# EAGLE design ClockMultiplier (EAGLE 7.5.0)
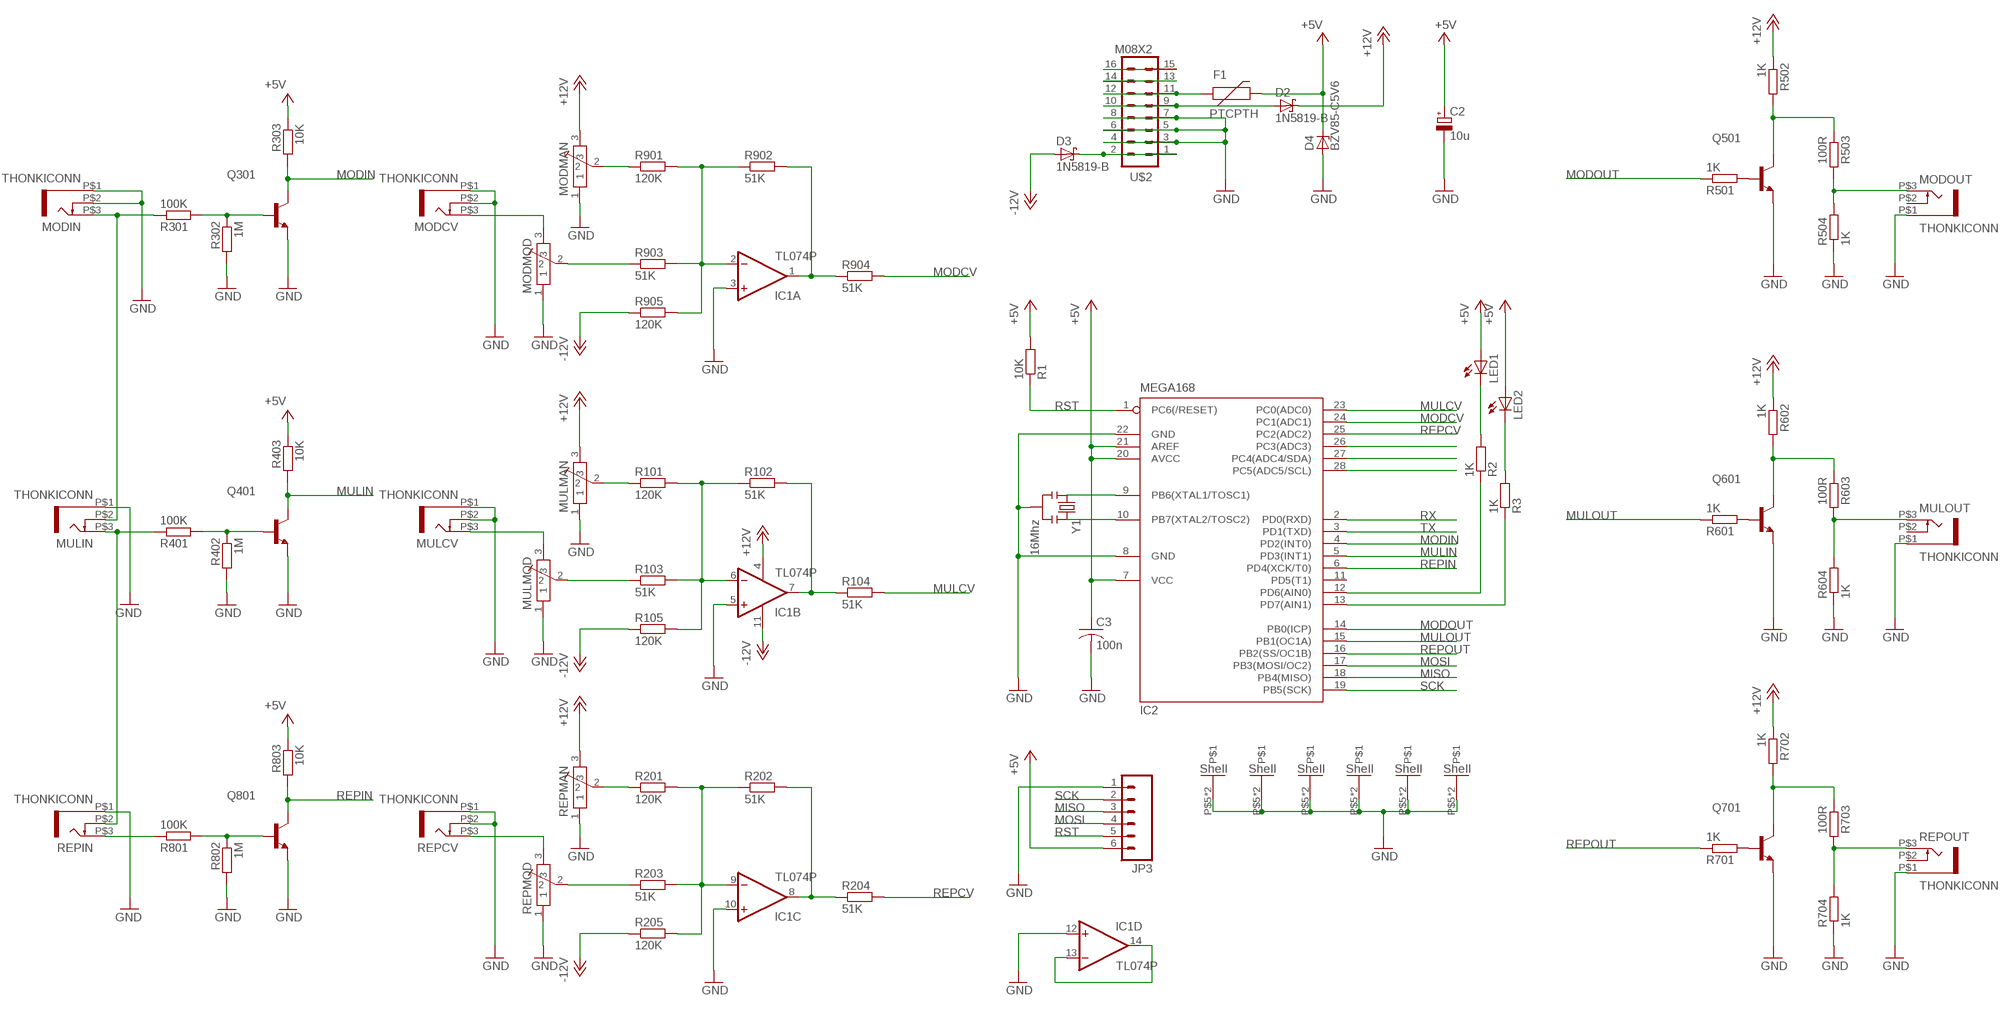
[diagram p0: schematic, sheet 1]

## Parts
C2  10u  CPOL-EUE5-6  [E5-6]
C3  100n  C-US050-024X044  [C050-024X044]
D2  1N5819-B  [DO41-7.6]
D3  1N5819-B  [DO41-7.6]
D4  BZV85-C5V6  ZENER-DIODEDO34-7  [DO34Z7]
F1  PTCPTH  [PTC]
IC1  TL074P  [DIL14]
IC2  MEGA168  MEGA8-P  [DIL28-3]
JP3  M06SIP  [1X06]
LED1  LED3MM  [LED3MM]
LED2  LED3MM  [LED3MM]
MODCV  THONKICONN  [THONKICONN]
MODIN  THONKICONN  [THONKICONN]
MODMAN  POT-ALPS-RK09L1140  [POT-ALPS-RK09L1140]
MODMOD  POT-ALPS-RK09L1140  [POT-ALPS-RK09L1140]
MODOUT  THONKICONN  [THONKICONN]
MULCV  THONKICONN  [THONKICONN]
MULIN  THONKICONN  [THONKICONN]
MULMAN  POT-ALPS-RK09L1140  [POT-ALPS-RK09L1140]
MULMOD  POT-ALPS-RK09L1140  [POT-ALPS-RK09L1140]
MULOUT  THONKICONN  [THONKICONN]
Q301  2N3904-NPN-TO92-EBC  [TO92-EBC]
Q401  2N3904-NPN-TO92-EBC  [TO92-EBC]
Q501  2N3904-NPN-TO92-EBC  [TO92-EBC]
Q601  2N3904-NPN-TO92-EBC  [TO92-EBC]
Q701  2N3904-NPN-TO92-EBC  [TO92-EBC]
Q801  2N3904-NPN-TO92-EBC  [TO92-EBC]
R1  10K  R-EU_0204/7  [0204/7]
R2  1K  R-EU_0204/7  [0204/7]
R3  1K  R-EU_0204/7  [0204/7]
R101  120K  R-EU_0204/7  [0204/7]
R102  51K  R-EU_0204/7  [0204/7]
R103  51K  R-EU_0204/7  [0204/7]
R104  51K  R-EU_0204/7  [0204/7]
R105  120K  R-EU_0204/7  [0204/7]
R201  120K  R-EU_0204/7  [0204/7]
R202  51K  R-EU_0204/7  [0204/7]
R203  51K  R-EU_0204/7  [0204/7]
R204  51K  R-EU_0204/7  [0204/7]
R205  120K  R-EU_0204/7  [0204/7]
R301  100K  R-EU_0204/7  [0204/7]
R302  1M  R-EU_0204/7  [0204/7]
R303  10K  R-EU_0204/7  [0204/7]
R401  100K  R-EU_0204/7  [0204/7]
R402  1M  R-EU_0204/7  [0204/7]
R403  10K  R-EU_0204/7  [0204/7]
R501  1K  R-EU_0204/7  [0204/7]
R502  1K  R-EU_0204/7  [0204/7]
R503  100R  R-EU_0204/7  [0204/7]
R504  1K  R-EU_0204/7  [0204/7]
R601  1K  R-EU_0204/7  [0204/7]
R602  1K  R-EU_0204/7  [0204/7]
R603  100R  R-EU_0204/7  [0204/7]
R604  1K  R-EU_0204/7  [0204/7]
R701  1K  R-EU_0204/7  [0204/7]
R702  1K  R-EU_0204/7  [0204/7]
R703  100R  R-EU_0204/7  [0204/7]
R704  1K  R-EU_0204/7  [0204/7]
R801  100K  R-EU_0204/7  [0204/7]
R802  1M  R-EU_0204/7  [0204/7]
R803  10K  R-EU_0204/7  [0204/7]
R901  120K  R-EU_0204/7  [0204/7]
R902  51K  R-EU_0204/7  [0204/7]
R903  51K  R-EU_0204/7  [0204/7]
R904  51K  R-EU_0204/7  [0204/7]
R905  120K  R-EU_0204/7  [0204/7]
REPCV  THONKICONN  [THONKICONN]
REPIN  THONKICONN  [THONKICONN]
REPMAN  POT-ALPS-RK09L1140  [POT-ALPS-RK09L1140]
REPMOD  POT-ALPS-RK09L1140  [POT-ALPS-RK09L1140]
REPOUT  THONKICONN  [THONKICONN]
U$2  M08X2  [2X8]
Y1  16Mhz  RESONATORPTH  [RESONATOR-PTH]

## Nets
+5V: C2.+ C3.1 D4.C F1.P$2 IC2.7(VCC) IC2.20(AVCC) IC2.21(AREF) JP3.6 LED1.A LED2.A R1.2 R303.1 R403.1 R803.1
+12V: D2.C IC1.4(P:V+) MODMAN.3 MULMAN.3 R502.1 R602.1 R702.1 REPMAN.3
-12V: D3.A IC1.11(P:V-) R105.1 R205.1 R905.1
DURSW: MODIN.P$3 MULIN.P$2 R301.1
GND: C2.- C3.2 D4.A IC1.3(A:+IN) IC1.5(B:+IN) IC1.10(C:+IN) IC1.12(D:+IN) IC2.8(GND) IC2.22(GND) JP3.1 MODCV.P$1 MODCV.P$2 MODIN.P$1 MODIN.P$2 MODMAN.1 MODMAN.P$5 MODMAN.P$6 MODMOD.1 MODMOD.P$5 MODMOD.P$6 MODOUT.P$1 MULCV.P$1 MULCV.P$2 MULIN.P$1 MULMAN.1 MULMAN.P$5 MULMAN.P$6 MULMOD.1 MULMOD.P$5 MULMOD.P$6 MULOUT.P$1 Q301.E Q401.E Q501.E Q601.E Q701.E Q801.E R302.2 R402.2 R504.1 R604.1 R704.1 R802.2 REPCV.P$1 REPCV.P$2 REPIN.P$1 REPMAN.1 REPMAN.P$5 REPMAN.P$6 REPMOD.1 REPMOD.P$5 REPMOD.P$6 REPOUT.P$1 U$2.3 U$2.4 U$2.5 U$2.6 U$2.7 U$2.8 Y1.2
MISO: IC2.18(PB4(MISO)) JP3.3
MODCV: IC2.24(PC1(ADC1)) R904.2
MODIN: IC2.4(PD2(INT0)) Q301.C R303.2
MODOUT: IC2.14(PB0(ICP)) R501.1
MOSI: IC2.17(PB3(MOSI/OC2)) JP3.4
MULCV: IC2.23(PC0(ADC0)) R104.2
MULIN: IC2.5(PD3(INT1)) Q401.C R403.2
MULOUT: IC2.15(PB1(OC1A)) R601.1
N$1: MULCV.P$3 MULMOD.3
N$2: IC1.6(B:-IN) R101.2 R102.1 R103.2 R105.2
N$3: MULMAN.2 R101.1
N$4: IC1.7(B:OUT) R102.2 R104.1
N$5: MULMOD.2 R103.1
N$6: D3.C U$2.1 U$2.2
N$7: IC1.9(C:-IN) R201.2 R202.1 R203.2 R205.2
N$8: R201.1 REPMAN.2
N$9: IC1.8(C:OUT) R202.2 R204.1
N$10: R203.1 REPMOD.2
N$11: IC1.13(D:-IN) IC1.14(D:OUT)
N$12: REPCV.P$3 REPMOD.3
N$13: IC2.26(PC3(ADC3))
N$14: IC2.27(PC4(ADC4/SDA))
N$15: IC2.28(PC5(ADC5/SCL))
N$16: IC1.2(A:-IN) R901.2 R902.1 R903.2 R905.2
N$17: MODMAN.2 R901.1
N$18: IC1.1(A:OUT) R902.2 R904.1
N$19: MODMOD.2 R903.1
N$20: IC2.9(PB6(XTAL1/TOSC1)) Y1.1
N$21: IC2.10(PB7(XTAL2/TOSC2)) Y1.3
N$22: MODCV.P$3 MODMOD.3
N$23: LED1.K(C) R2.2
N$24: LED2.K(C) R3.2
N$25: IC2.13(PD7(AIN1)) R3.1
N$26: Q601.B R601.2
N$27: Q301.B R301.2 R302.1
N$28: MODOUT.P$3 R503.2 R504.2
N$29: IC2.12(PD6(AIN0)) R2.1
N$30: MULOUT.P$3 R603.2 R604.2
N$31: Q401.B R401.2 R402.1
N$32: Q601.C R602.2 R603.1
N$33: Q501.B R501.2
N$34: Q701.B R701.2
N$35: R703.2 R704.2 REPOUT.P$3
N$36: MULIN.P$3 R401.1 REPIN.P$2
N$37: Q501.C R502.2 R503.1
N$38: Q701.C R702.2 R703.1
N$39: Q801.B R801.2 R802.1
N$41: R801.1 REPIN.P$3
N$43: U$2.13 U$2.14
N$44: F1.P$1 U$2.11 U$2.12
N$45: D2.A U$2.9 U$2.10
PWR_BUS: U$2.15 U$2.16
REPCV: IC2.25(PC2(ADC2)) R204.2
REPIN: IC2.6(PD4(XCK/T0)) Q801.C R803.2
REPOUT: IC2.16(PB2(SS/OC1B)) R701.1
RST: IC2.1(PC6(/RESET)) JP3.5 R1.1
RX: IC2.2(PD0(RXD))
SCK: IC2.19(PB5(SCK)) JP3.2
TX: IC2.3(PD1(TXD))
Unconnected: IC2.11(PD5(T1)) MODOUT.P$2 MULOUT.P$2 REPOUT.P$2

## Library data of the parts
C2 = rcl:CPOL-EU: POLARIZED CAPACITOR, European symbol
C3 = rcl:C-US: CAPACITOR, American symbol
D2 D3 = diode:1N581*: 1.0A SCHOTTKY BARRIER RECTIFIER Source: http://www.diodes.com/datasheets/ds23001.pdf
D4 = diode:ZENER-DIODE: Z-Diode
F1 = Rebel:PTC: Resettable Fuse PTC
IC1 = linear:TL074: OP AMP
IC2 = atmel:MEGA8-P: MICROCONTROLLER 8 Kbytes FLASH, 1 kbytes SRAM, 512 bytes EEPROM, USART, 4-channel 10 bit ADC, 2-channel 8 bit ADC Pin compatible with Atmega48, ATMega88, ATMega168 Source: avr.lbr; OC_FARNELL: unknown; OC_NEWARK: unknown
JP3 = SparkFun:M06: Header 6 Standard 6-pin 0.1" header. Use with straight break away headers (SKU : PRT-00116), right angle break away headers (PRT-00553), swiss pins (PRT-00743), machine pins (PRT-00117), and female headers (PRT-00115). Molex polarized connector foot print use with SKU : PRT-08094 with associated crimp pins and housings. NOTES ON THE VARIANTS LOCK and LOCK_LONGPADS... This footprint was designed to help hold the alignment of a through-hole component (i.e. 6-pin header) while soldering it into place. You may notice that each hole has been shifted either up or down by 0.005 of an inch from it's more standard position (which is a perfectly straight line). This slight alteration caused the pins (the squares in the middle) to touch the edges of the holes. Because they are alternating, it causes a "brace" to hold the component in place. 0.005 has proven to be the perfect amount of "off-center" position when using our standard breakaway headers. Although looks a little odd when you look at the bare footprint, once you have a header in there, the alteration is very hard to notice. Also, if you push a header all the way into place, it is covered up entirely on the bottom side. This idea of altering the position of holes to aid alignment will be further integrated into the Sparkfun Library for other footprints. It can help hold any component with 3 or more connection pins.
LED1 LED2 = Rebel:LED: LED OSRAM: - CHIPLED LG R971, LG N971, LY N971, LG Q971, LY Q971, LO R971, LY R971 LH N974, LH R974 LS Q976, LO Q976, LY Q976 LO Q996 - Hyper CHIPLED LW Q18S LB Q993, LB Q99A, LB R99A - SideLED LS A670, LO A670, LY A670, LG A670, LP A670 LB A673, LV A673, LT A673, LW A673 LH A674 LY A675 LS A676, LA A676, LO A676, LY A676, LW A676 LS A679, LY A679, LG A679 - Hyper Micro SIDELED® LS Y876, LA Y876, LO Y876, LY Y876 LT Y87S - SmartLED LW L88C, LW L88S LB L89C, LB L89S, LG L890 LS L89K, LO L89K, LY L89K LS L896, LA L896, LO L896, LY L896 - TOPLED LS T670, LO T670, LY T670, LG T670, LP T670 LSG T670, LSP T670, LSY T670, LOP T670, LYG T670 LG T671, LOG T671, LSG T671 LB T673, LV T673, LT T673, LW T673 LH T674 LS T676, LA T676, LO T676, LY T676, LB T676, LH T676, LSB T676, LW T676 LB T67C, LV T67C, LT T67C, LS T67K, LO T67K, LY T67K, LW E67C LS E67B, LA E67B, LO E67B, LY E67B, LB E67C, LV E67C, LT E67C LW T67C LS T679, LY T679, LG T679 LS T770, LO T770, LY T770, LG T770, LP T770 LB T773, LV T773, LT T773, LW T773 LH T774 LS E675, LA E675, LY E675, LS T675 LS T776, LA T776, LO T776, LY T776, LB T776 LHGB T686 LT T68C, LB T68C - Hyper Mini TOPLED® LB M676 - Mini TOPLED Santana® LG M470 LS M47K, LO M47K, LY M47K Source: http://www.osram.convergy.de LUXEON: - LUMILED® LXK2-PW12-R00, LXK2-PW12-S00, LXK2-PW14-U00, LXK2-PW14-V00 LXK2-PM12-R00, LXK2-PM12-S00, LXK2-PM14-U00 LXK2-PE12-Q00, LXK2-PE12-R00, LXK2-PE12-S00, LXK2-PE14-T00, LXK2-PE14-U00 LXK2-PB12-K00, LXK2-PB12-L00, LXK2-PB12-M00, LXK2-PB14-N00, LXK2-PB14-P00, LXK2-PB14-Q00 LXK2-PR12-L00, LXK2-PR12-M00, LXK2-PR14-Q00, LXK2-PR14-R00 LXK2-PD12-Q00, LXK2-PD12-R00, LXK2-PD12-S00 LXK2-PH12-R00, LXK2-PH12-S00 LXK2-PL12-P00, LXK2-PL12-Q00, LXK2-PL12-R00 Source: www.luxeon.com KINGBRIGHT: KA-3528ASYC Source: www.kingbright.com
MODCV MODIN MODOUT MULCV MULIN MULOUT REPCV REPIN REPOUT = Rebel:THONKICONN
MODMAN MODMOD MULMAN MULMOD REPMAN REPMOD = Rebel:POT-ALPS-RK09L
Q301 Q401 Q501 Q601 Q701 Q801 = transistor-neu-to92:*-NPN-: NPN Transistror
R1-R3 R101-R105 R201-R205 R301-R303 R401-R403 R501-R504 R601-R604 R701-R704 R801-R803 R901-R905 = Rebel:R-EU_: RESISTOR, European symbol
U$2 = SparkFun:M08X2
Y1 = SparkFun:RESONATOR: Resonator Small SMD resonator. This is the itty bitty 10/20MHz resonators with built in caps. CSTCE10M0G55 and CSTCE20M0V53. Footprint has been reviewed closely but hasn't been tested yet.

## Board
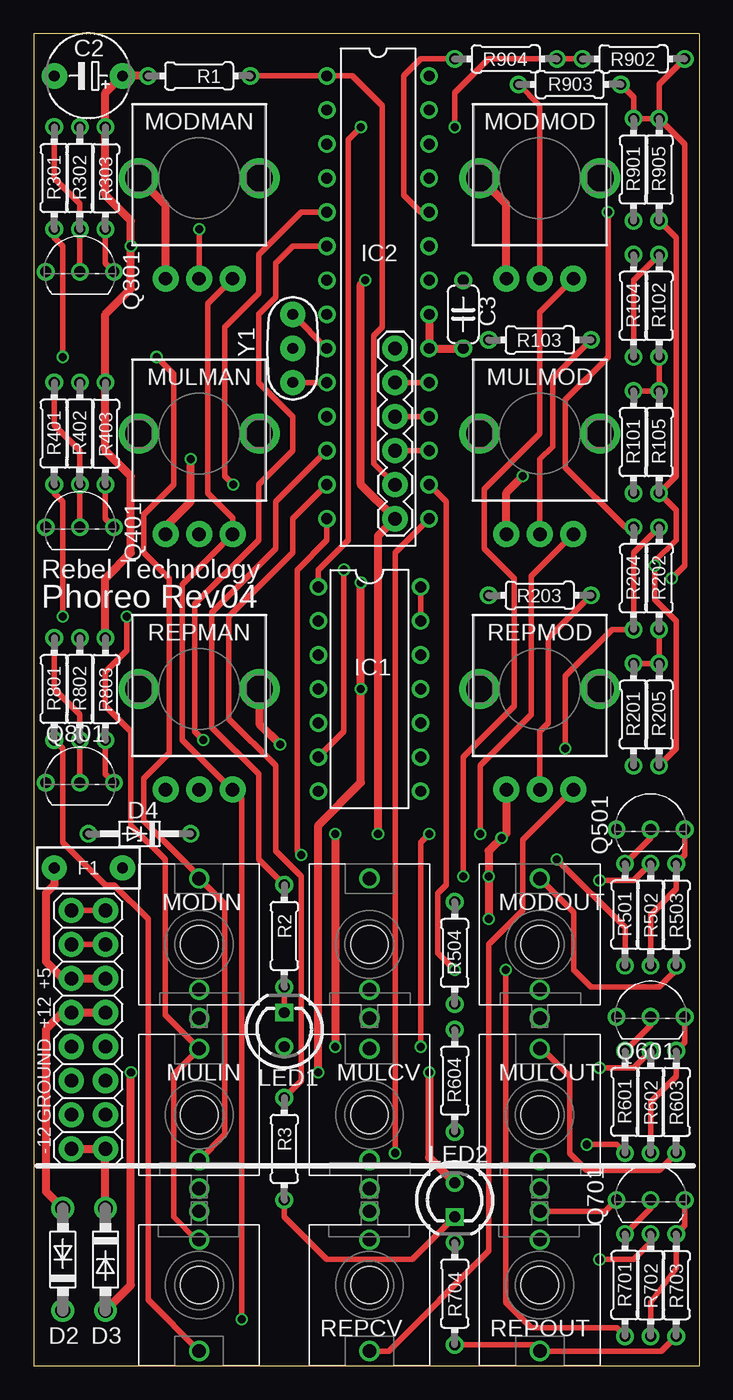
[diagram p1: board, top side]
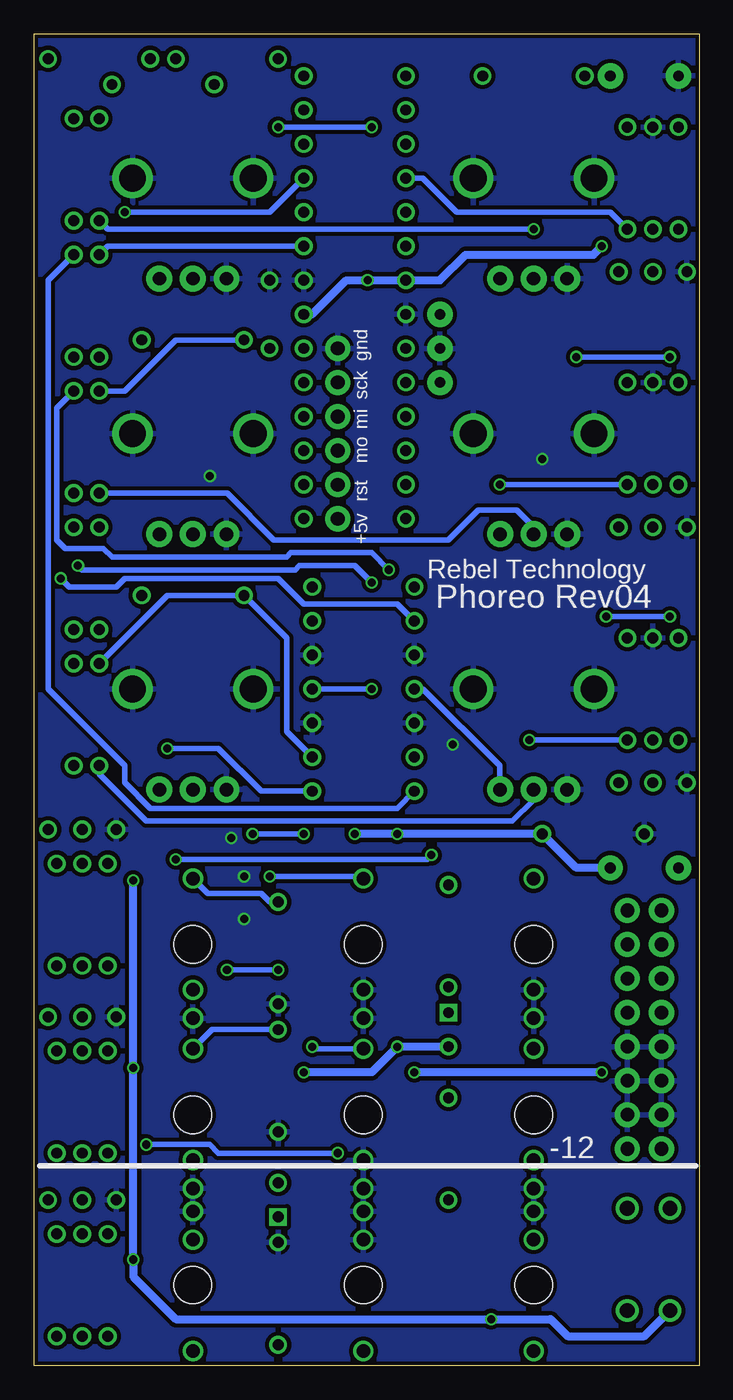
[diagram p2: board, bottom side, seen from below]

Size 49.63 x 99.37 mm. Coordinates in mm from the lower left corner, seen from the top.
Outline: 49.63,99.37 0,99.37 0,0 49.63,0 49.63,99.37
Copper layers (1*16): Top 0.035mm / dielectric 1.5mm / Bottom 0.035mm
Design rules "Fusion_eagle_rule_v1.1": minimum track width 6mil, minimum drill 12mil, track to track 6mil, track to pad 6mil, pad to pad 6mil, via to via 6mil, smd to smd 0mil, copper to edge 10mil, drill to drill 10mil, minimum pad ring 10mil, minimum via ring 6mil, stop-mask expansion 2mil, vias tented up to drill 100mil, thermal gap 10mil

### Footprints (pad centres in the part's own frame; a part is rotated, then mirrored left to right if it is on the bottom)
E5-6 = drill 0.813 pad 1.905: + -2.54,0; - 2.54,0
C050-024X044 = drill 0.813: 1 -2.54,0; 2 2.54,0
DO41-7.6 = drill 1.1 pad 1.7: A 3.81,0; C -3.81,0
DO34Z7 = drill 0.813: A 3.81,0; C -3.81,0
PTC = drill 0.8 pad 1.88: P$1 -2.54,0; P$2 2.54,0
DIL14 = drill 0.813: 1 -7.62,-3.81; 2 -5.08,-3.81; 3 -2.54,-3.81; 4 0,-3.81; 5 2.54,-3.81; 6 5.08,-3.81; 7 7.62,-3.81; 8 7.62,3.81; 9 5.08,3.81; 10 2.54,3.81; 11 0,3.81; 12 -2.54,3.81; 13 -5.08,3.81; 14 -7.62,3.81
DIL28-3 = drill 0.813: 1 -16.51,-3.81; 2 -13.97,-3.81; 3 -11.43,-3.81; 4 -8.89,-3.81; 5 -6.35,-3.81; 6 -3.81,-3.81; 7 -1.27,-3.81; 8 1.27,-3.81; 9 3.81,-3.81; 10 6.35,-3.81; 11 8.89,-3.81; 12 11.43,-3.81; 13 13.97,-3.81; 14 16.51,-3.81; 15 16.51,3.81; 16 13.97,3.81; 17 11.43,3.81; 18 8.89,3.81; 19 6.35,3.81; 20 3.81,3.81; 21 1.27,3.81; 22 -1.27,3.81; 23 -3.81,3.81; 24 -6.35,3.81; 25 -8.89,3.81; 26 -11.43,3.81; 27 -13.97,3.81; 28 -16.51,3.81
1X06 = drill 1.016 pad 1.88: 1 0,0; 2 2.54,0; 3 5.08,0; 4 7.62,0; 5 10.16,0; 6 12.7,0
LED3MM = drill 0.813: A -1.27,0 | drill 0.813 square: K 1.27,0
THONKICONN = drill 1: P$1 0,-5.5; P$2 0,-3.38; P$3 0,4.92 | hole 2.8: 0,0
POT-ALPS-RK09L1140 = drill 1 pad 1.93: 1 -2.5,-7.5; 2 0,-7.5; 3 2.5,-7.5 | drill 2: P$5 -4.5,0; P$6 4.5,0
TO92-EBC = drill 0.813: B 0,-1.27; C 2.54,-1.27; E -2.54,-1.27
0204/7 = drill 0.813: 1 -3.81,0; 2 3.81,0
2X8 = drill 1.016 pad 1.88: 1 0,0; 2 0,2.54; 3 2.54,0; 4 2.54,2.54; 5 5.08,0; 6 5.08,2.54; 7 7.62,0; 8 7.62,2.54; 9 10.16,0; 10 10.16,2.54; 11 12.7,0; 12 12.7,2.54; 13 15.24,0; 14 15.24,2.54; 15 17.78,0; 16 17.78,2.54
RESONATOR-PTH = drill 0.8 pad 1.88: 1 -2.54,0; 2 0,0; 3 2.54,0

### Placement (x,y rotation side)
C2  4.09,96.2 180 top
C3  32.03,78.42 90 top
D2  2.18,7.94 90 top
D3  5.36,7.94 270 top
D4  7.9,39.69 180 top
F1  4.09,37.15 0 top
IC1  25.04,50.48 270 top
IC2  25.68,79.69 270 top
JP3  26.95,75.88 270 top
LED1  18.69,25.08 90 top
LED2  31.39,12.38 270 top
MODCV  25.04,31.43 0 top
MODIN  12.34,31.43 0 top
MODMAN  12.34,88.58 0 top
MODMOD  37.74,88.58 0 top
MODOUT  37.74,31.43 0 top
MULCV  25.04,18.73 0 top
MULIN  12.34,18.73 0 top
MULMAN  12.34,69.53 0 top
MULMOD  37.74,69.53 0 top
MULOUT  37.74,18.73 0 top
Q301  3.45,82.87 0 top
Q401  3.45,63.82 0 top
Q501  46,41.27 0 top
Q601  46,27.3 0 top
Q701  46,13.65 0 top
Q801  3.45,44.77 0 top
R1  12.34,96.2 180 top
R2  18.69,32.07 270 top
R3  18.69,16.19 270 top
R101  44.73,68.9 90 top
R102  46.63,79.06 90 top
R103  37.74,76.52 180 top
R104  44.73,79.06 90 top
R105  46.63,68.9 90 top
R201  44.73,48.58 90 top
R202  46.63,58.74 90 top
R203  37.74,57.47 180 top
R204  44.73,58.74 90 top
R205  46.63,48.58 90 top
R301  1.55,88.58 90 top
R302  3.45,88.58 90 top
R303  5.36,88.58 270 top
R401  1.55,69.53 90 top
R402  3.45,69.53 90 top
R403  5.36,69.53 270 top
R501  44.09,33.65 90 top
R502  46,33.65 270 top
R503  47.9,33.65 270 top
R504  31.39,30.8 90 top
R601  44.09,19.69 90 top
R602  46,19.69 270 top
R603  47.9,19.69 270 top
R604  31.39,21.27 90 top
R701  44.09,6.03 90 top
R702  46,6.03 270 top
R703  47.9,6.03 270 top
R704  31.39,5.4 270 top
R801  1.55,50.48 90 top
R802  3.45,50.48 90 top
R803  5.36,50.48 270 top
R901  44.73,89.22 90 top
R902  44.73,97.47 180 top
R903  39.97,95.57 0 top
R904  35.2,97.47 180 top
R905  46.63,89.22 90 top
REPCV  25.04,6.03 180 top
REPIN  12.34,6.03 180 top
REPMAN  12.34,50.48 0 top
REPMOD  37.74,50.48 0 top
REPOUT  37.74,6.03 180 top
U$2  5.36,16.19 90 top
Y1  19.33,75.88 270 top

### Tracks (layer width: path | path; a pad name or v marks a point on that pad's centre or on a via)
+5V  (via drill 0.6)
  Top 0.61: R803.1 5.36,58.74 7.26,60.64 7.26,66.36 5.36,68.26 R403.1 5.36,78.42 7.26,80.33 v7.26,83.5 7.26,85.41 5.36,87.31 R303.1 5.36,94.93 C2.+ R1.2 | v25.68,39.69 25.68,61.91 JP3.6 24.41,65.72 24.41,80.65 v24.73,80.96 | IC2.21 IC2.20 C3.1 | v22.5,39.69 v22.5,23.81 | v29.49,21.91 29.49,15.56 LED2.A
  Bottom 0.61: F1.P$2 9.17,37.15 D4.C v22.5,39.69 v25.68,39.69 | IC2.21 28.85,78.42 26.31,80.96 v24.73,80.96 IC2.7 19.33,80.96 17.42,82.87 7.9,82.87 v7.26,83.5 | LED1.A v22.5,23.81 24.41,21.91 v29.49,21.91
+12V  (via drill 0.6)
  Top 0.406: R702.1 46,9.21 44.73,7.94 v42.19,7.94 | v42.19,22.23 44.73,22.23 R602.1 | v42.19,36.2 44.73,36.2 R502.1 | MODMAN.3 12.98,79.22 12.98,65.09 14.84,63.22 MULMAN.3 11.07,58.26 11.07,46.67 14.76,42.98 REPMAN.3 15.52,42.31 v15.52,3.49
  Bottom 0.406: IC1.4 20.6,50.48 14.88,44.77 14.88,43.02 REPMAN.3
  Bottom 0.61: v42.19,36.2 v42.19,22.23 v42.19,7.94 42.19,6.67 39.01,3.49 v15.52,3.49 11.07,3.49 9.8,2.22 4.09,2.22 D2.C
-12V  (via drill 0.6)
  Top 0.406: R205.1 47.9,46.04 47.9,55.56 46.32,57.15 v46.32,59.69 46.32,60.01 47.9,61.6 47.9,63.82 R105.1 47.9,66.36 47.9,84.14 R905.1
  Top 0.61: v7.26,21.91 7.26,6.03 D3.A | v21.23,21.91 21.23,40.32 24.41,43.5 v24.41,50.48 v24.41,58.42
  Bottom 0.406: IC1.11 v24.41,50.48 | v24.41,58.42 25.68,59.69 29.81,59.69 30.12,59.37 46,59.37 v46.32,59.69
  Bottom 0.61: v7.26,21.91 v21.23,21.91
DURSW  (via drill 0.6)
  Top 0.406: MULIN.P$2 14.25,17.26 14.25,34.45 MODIN.P$3 12.34,36.51 8.22,40.64 8.22,43.82 10.12,45.72 10.12,58.74 8.22,60.64 8.22,63.5 10.44,65.72 10.44,73.98 v9.17,75.25 | R301.1 1.55,84.14 2.18,83.5 v2.18,75.25
  Bottom 0.406: v2.18,75.25 v9.17,75.25
GND  (via drill 0.6)
  Top 0.406: REPOUT.P$1 42.61,11.53 Q701.E
  Top 0.61: MULMOD.1 35.24,65.13 v36.47,66.36 | MODMOD.P$5 33.3,88.58 35.2,86.68 35.2,81.12 MODMOD.1 | MODMAN.P$5 9.84,86.58 MODMAN.1 | MULMAN.1 9.84,62.59 11.71,64.45 v11.71,67.63 | REPMAN.P$6 16.84,47.89 v18.38,46.35 | REPMOD.1 35.24,39.73 v34.89,39.37 33.93,38.42 v33.93,36.51 v33.93,33.34
  pour Bottom (isolate 0.305): 50.44,0.32 -0.36,0.32 -0.36,100.65 50.44,100.65
MISO
  Top 0.406: JP3.3 IC2.18
MODCV
  Top 0.406: IC2.24 28.85,86.04 27.58,87.31 27.58,96.2 28.85,97.47 R904.2
MODIN
  Top 0.406: R303.2 5.36,82.23 Q301.C
  Bottom 0.406: R303.2 6.63,86.04 18.06,86.04 20.6,88.58 IC2.4
MODOUT  (via drill 0.6)
  Top 0.406: R501.1 44.09,32.7 v39.01,37.78 | v19.96,38.1 19.65,38.42 19.65,59.37 21.87,61.6 IC2.14
  Bottom 0.406: v39.01,37.78 20.28,37.78 v19.96,38.1
MOSI
  Top 0.406: JP3.4 IC2.17
MULCV
  Bottom 0.406: R104.2 44.09,83.5 IC2.23
MULIN  (via drill 0.6)
  Top 0.406: R403.2 5.36,63.18 Q401.C | IC2.5 19.96,86.04 16.79,82.87 16.79,80.01 14.25,77.47 14.25,66.36 v14.88,65.72
  Bottom 0.406: v14.88,65.72 R403.2
MULOUT  (via drill 0.6)
  Top 0.406: v26.95,15.87 26.95,60.64 IC2.15 | v41.24,16.51 43.46,16.51 R601.1
  Bottom 0.406: v41.24,16.51 36.47,16.51 35.84,15.87 v26.95,15.87
N$1  (via drill 0.6)
  Top 0.406: v28.85,23.81 28.85,39.05 v29.49,39.69 | v33.3,39.69 33.3,44.77 37.11,48.58 37.11,58.9 MULMOD.3
  Bottom 0.406: MULCV.P$3 28.69,23.65 v28.85,23.81 | v29.49,39.69 v33.3,39.69
N$2  (via drill 0.6)
  Top 0.406: R101.2 R105.2 R102.1 | v23.14,59.37 23.14,47.31 IC1.6
  Bottom 0.406: R103.2 39.01,76.52 42.82,72.71 R101.2 | v23.14,59.37 24.41,60.64 30.44,60.64 30.76,60.32 43.78,60.32 44.41,60.96 47.27,60.96 47.9,61.6 47.9,71.44 R105.2
N$3
  Bottom 0.406: MULMAN.2 12.34,62.55 13.61,63.82 16.47,63.82 18.69,61.6 31.71,61.6 35.2,65.09 R101.1
N$4
  Top 0.406: R104.1 44.73,80.96 R102.2
  Bottom 0.406: R102.2 48.54,80.96 48.54,50.48 42.82,44.77 42.82,43.5 40.92,41.59 22.5,41.59 IC1.7
N$5
  Top 0.406: MULMOD.2 37.74,67.63 38.7,68.58 38.7,73.66 R103.1
N$6
  Top 0.61: U$2.2 U$2.1 D3.C
N$7
  Top 0.406: R201.2 R205.2 R202.1
  Bottom 0.406: R201.2 39.65,57.47 R203.2 30.76,54.29 30.76,47.31 IC1.9
N$8
  Bottom 0.406: REPMAN.2 12.34,42.23 13.93,40.64 41.24,40.64 44.73,44.13 R201.1
N$9  (via drill 0.6)
  Top 0.406: R202.2 44.73,60.64 R204.1 43.14,54.93 39.65,51.43 v39.65,46.04
  Bottom 0.406: v39.65,46.04 35.84,46.04 32.66,42.86 IC1.8
N$10
  Top 0.406: REPMOD.2 37.74,47.31 38.38,47.94 38.38,54.29 R203.1
N$11
  Top 0.406: IC1.13 IC1.14
N$12
  Top 0.406: REPCV.P$3 26.47,1.11 33.93,8.57 33.93,31.43 36.47,33.97 36.47,39.21 REPMOD.3
N$16  (via drill 0.6)
  Top 0.406: R905.2 48.54,91.12 48.54,59.69 v47.59,58.74 | R905.2 R901.2 44.73,94.62 R903.2 | R905.2 46.63,95.57 R902.1
  Bottom 0.406: v47.59,58.74 46.95,58.1 43.46,58.1 42.82,58.74 31.39,58.74 29.49,56.83 22.5,56.83 IC1.2
N$17  (via drill 0.6)
  Top 0.406: MODMAN.2 v12.34,84.77
  Bottom 0.406: v12.34,84.77 44.09,84.77 R901.1
N$18  (via drill 0.6)
  Top 0.406: v24.41,92.39 23.46,91.44 23.46,61.6 21.23,59.37 IC1.1 | R902.2 R904.1 33.93,97.47 31.39,94.93 v31.39,92.39
  Bottom 0.406: v24.41,92.39 v31.39,92.39
N$19
  Top 0.406: MODMOD.2 37.74,93.98 R903.1
N$20
  Top 0.406: Y1.1 IC2.9
N$21
  Top 0.406: Y1.3 IC2.10
N$22  (via drill 0.6)
  Top 0.406: v32.03,36.51 32.03,45.4 35.84,49.21 35.84,58.74 33.62,60.96 33.62,65.4 37.74,69.53 37.74,78.58 MODMOD.3
  Bottom 0.406: v32.03,36.51 25.2,36.51 MODCV.P$3
N$23
  Top 0.406: LED1.K R2.2
N$24
  Top 0.406: R3.2 18.69,11.11 21.87,7.94 28.22,7.94 LED2.K
N$25
  Top 0.406: IC2.13 19.33,63.18 19.33,60.64 14.57,55.88 14.57,48.26 18.06,44.77 18.06,38.42 19.96,36.51 19.96,21.27 R3.1
N$26
  Top 0.406: Q601.B 46,25.4 R601.2
N$27
  Top 0.406: R301.2 1.55,88.58 3.45,86.68 R302.1 Q301.B
N$28
  Top 0.406: R503.2 47.9,29.53 46.63,28.26 41.55,28.26 40.28,29.53 40.28,33.81 MODOUT.P$3
  Bottom 0.406: R504.2 32.03,34.61 32.66,35.24 36.63,35.24 MODOUT.P$3
N$29
  Top 0.406: IC2.12 18.06,64.45 18.06,60.96 13.3,56.2 13.3,47.63 16.79,44.13 16.79,37.78 R2.1
N$30
  Top 0.406: MULOUT.P$3 37.9,23.65 39.97,21.59 39.97,15.87 41.24,14.6 46.63,14.6 R603.2
  Bottom 0.406: R604.2 36.31,25.08 MULOUT.P$3
N$31
  Top 0.406: Q401.B R402.1 3.45,68.26 1.55,70.17 R401.2
N$32
  Top 0.406: R602.2 46,19.69 47.9,21.59 R603.1 48.54,24.13 Q601.C
N$33
  Top 0.406: Q501.B 46,39.37 R501.2
N$34
  Top 0.406: Q701.B 46,11.75 R701.2
N$35
  Top 0.406: R704.2 37.27,1.59 REPOUT.P$3 46.79,1.11 R703.2
N$36  (via drill 0.6)
  Top 0.406: R401.1 1.55,65.09 2.18,64.45 v2.18,55.88 | v6.95,55.88 6.95,53.34 5.36,51.75 5.36,49.21 7.26,47.31 7.26,40.32 9.8,37.78 9.8,26.19 MULIN.P$3 10.44,21.75 10.44,11.11 12.14,9.41 REPIN.P$2
  Bottom 0.406: v2.18,55.88 v6.95,55.88
N$37
  Top 0.406: Q501.C 48.54,38.1 R503.1 47.9,35.56 46,33.65 R502.2
N$38
  Top 0.406: R702.2 46,4.76 47.9,7.3 R703.1 48.54,10.48 Q701.C
N$39
  Top 0.406: Q801.B R802.1 3.45,48.58 1.55,50.48 R801.2
N$41
  Top 0.406: REPIN.P$3 8.53,4.92 8.53,33.34 5.99,35.88 5.36,35.88 2.18,39.05 2.18,46.04 R801.1
N$43
  Top 0.406: U$2.14 U$2.13
N$44
  Top 0.61: F1.P$1 1.55,35.88 0.91,35.24 0.91,30.16 2.18,28.89 U$2.12 U$2.11
N$45
  Top 0.61: U$2.9 U$2.10 2.18,26.35 0.91,25.08 0.91,13.02 D2.A
PWR_BUS
  Top 0.406: U$2.16 U$2.15
REPCV  (via drill 0.6)
  Top 0.406: R204.2 44.09,62.55 39.65,66.99 39.65,72.07 42.82,75.25 v42.82,86.04
  Bottom 0.406: v42.82,86.04 32.03,86.04 IC2.25
REPIN  (via drill 0.6)
  Top 0.406: R803.2 5.36,44.13 Q801.C | IC2.6 19.33,83.5 18.06,82.23 18.06,79.69 16.79,78.42 16.79,73.34 19.33,70.8 19.33,68.26 16.79,65.72 16.79,61.6 12.03,56.83 12.03,47.31 v12.66,46.67
  Bottom 0.406: v12.66,46.67 R803.2
REPOUT  (via drill 0.6)
  Top 0.406: R701.1 43.46,2.86 37.11,2.86 35.2,4.76 v35.2,29.53 | IC2.16 30.76,64.45 30.76,35.88 30.12,35.24 30.12,30.8 v31.39,29.53
  Bottom 0.406: v35.2,29.53 v31.39,29.53
RST
  Top 0.406: JP3.5 25.36,67.31 25.36,76.84 26,77.47 26,93.98 23.77,96.2 IC2.1 R1.1
SCK
  Top 0.406: JP3.2 IC2.19

### Text on the board
tPlace: Rebel Technology | Phoreo Rev04 | +5 | +12 | GROUND | -12
bPlace: gnd | sck | mi | mo | rst | +5v | Rebel Technology | Phoreo Rev04 | -12
tNames: Y1